# EAGLE design AMS00x (EAGLE 6.1)
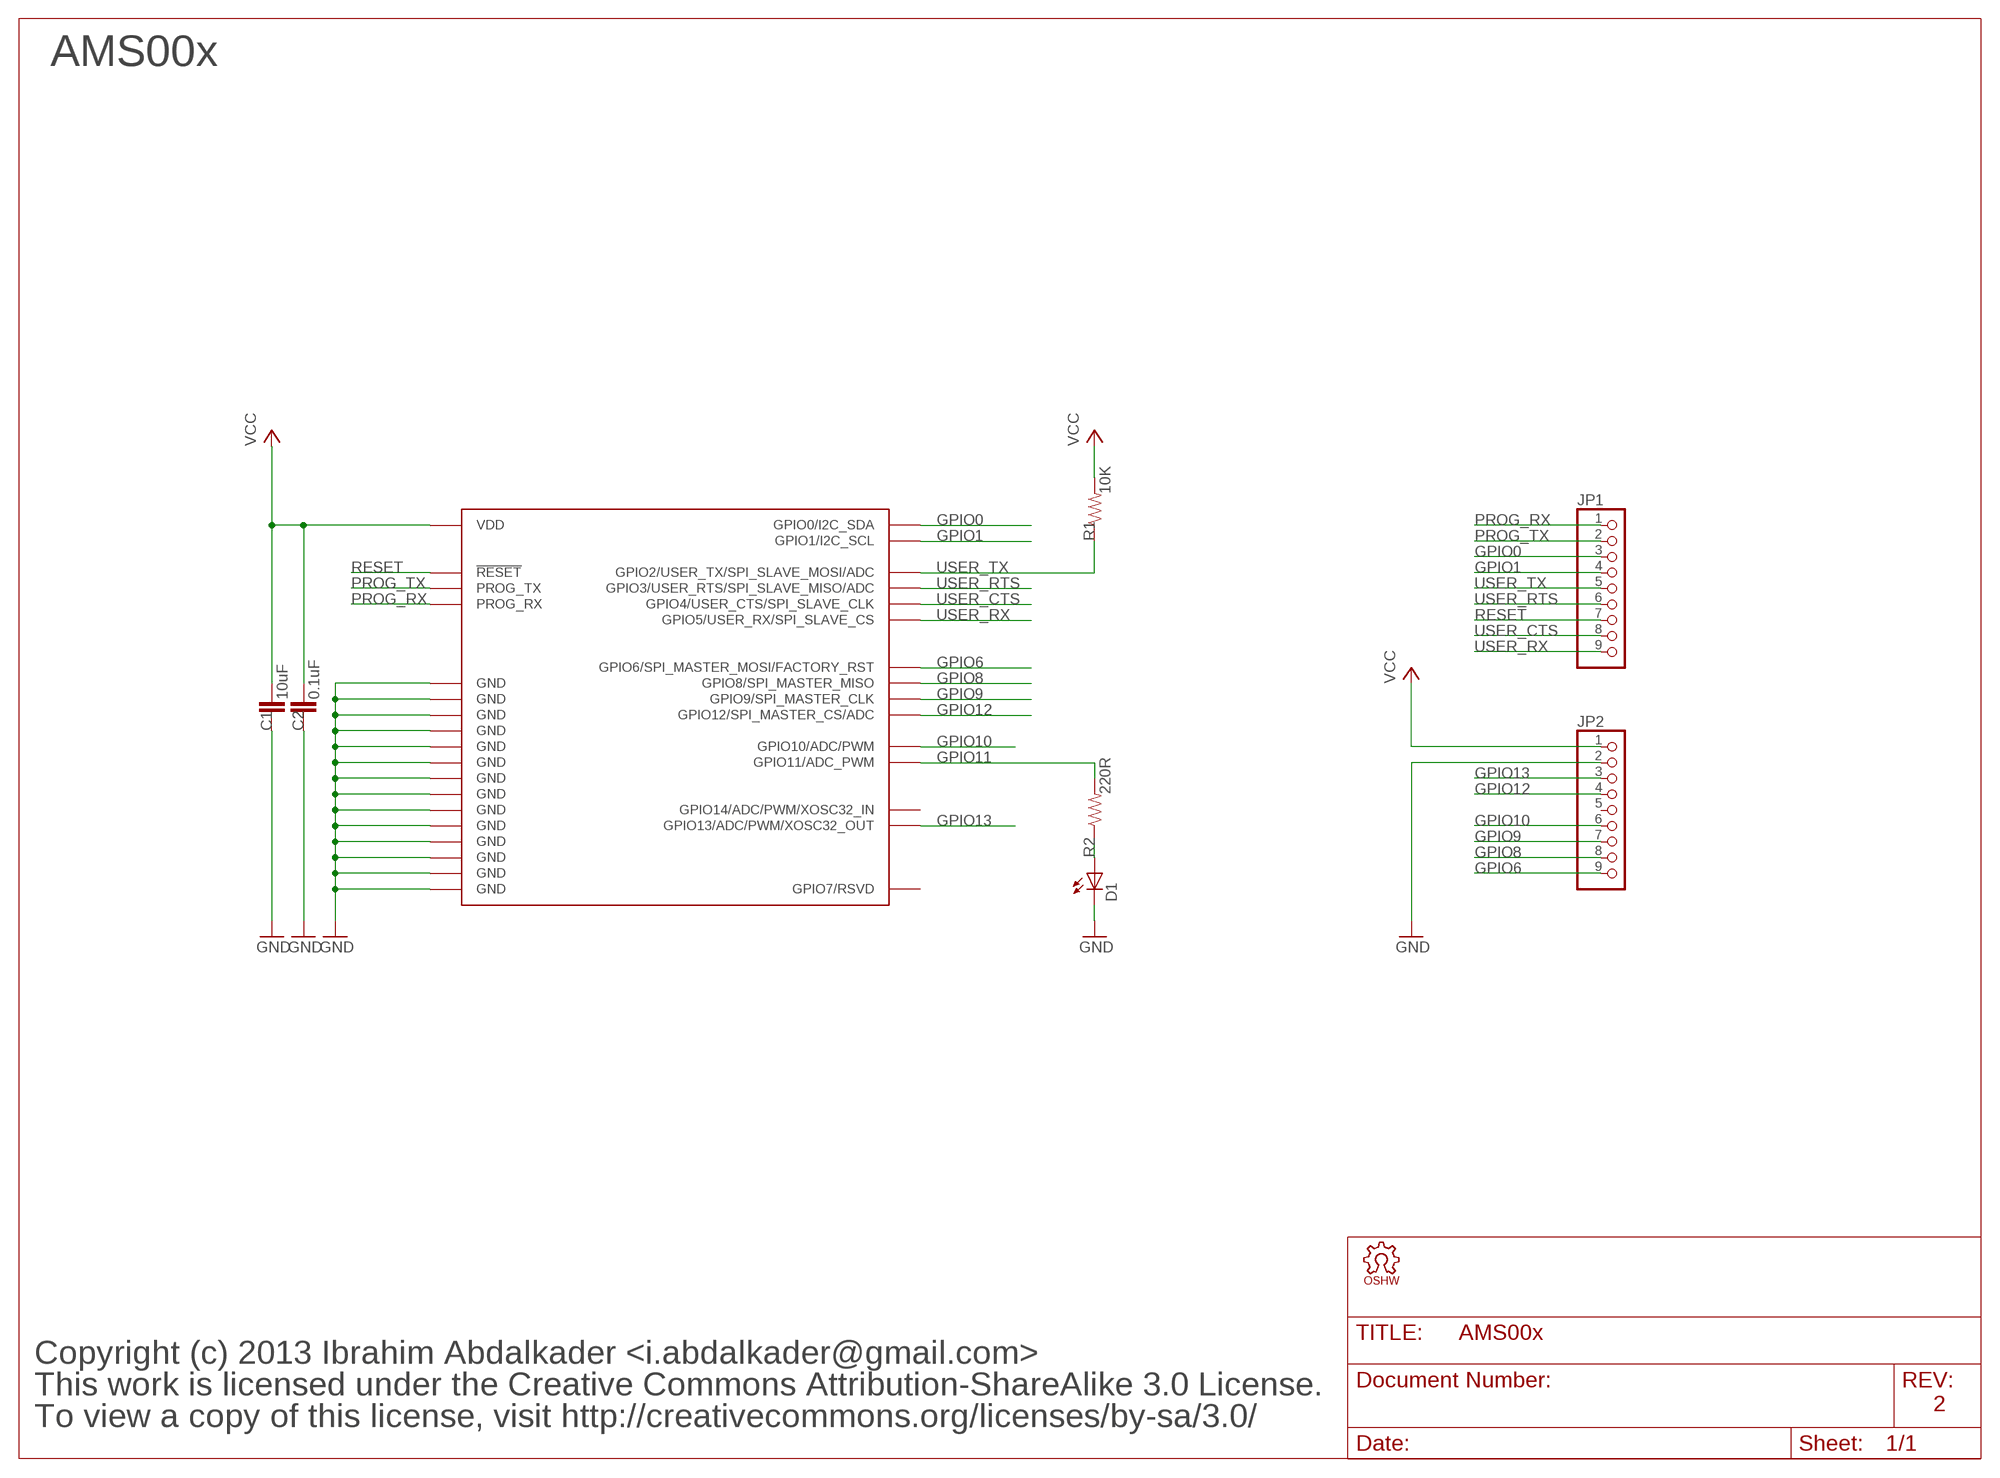
[diagram p0: schematic, sheet 1]

## Parts
C1  10uF  CAP0603-CAP  [0603-CAP]
C2  0.1uF  CAP0603-CAP  [0603-CAP]
D1  LED0603  [LED-0603]
JP1  PINHD-1X9  [1X09]
JP2  PINHD-1X9  [1X09]
LOGO1  OSHW_LOGO_6MILX0100-NT  [OSHW_6X100_NOTEXT]
R1  10K  RESISTOR0603-RES  [0603-RES]
R2  220R  RESISTOR0603-RES  [0603-RES]
U$3  AMS00X  [AMS00X]

## Nets
GND: C1.1 C2.1 D1.C JP2.2 U$3.P$1(GND) U$3.P$19(GND) U$3.P$22(GND) U$3.P$23(GND) U$3.P$24(GND) U$3.P$25(GND) U$3.P$26(GND) U$3.P$27(GND) U$3.P$28(GND) U$3.P$29(GND) U$3.P$30(GND) U$3.P$31(GND) U$3.P$32(GND) U$3.P$33(GND)
GPIO0: JP1.3 U$3.P$4(GPIO0/I2C_SDA)
GPIO1: JP1.4 U$3.P$5(GPIO1/I2C_SCL)
GPIO6: JP2.9 U$3.P$11(GPIO6/SPI_MASTER_MOSI/FACTORY_RST)
GPIO8: JP2.8 U$3.P$13(GPIO8/SPI_MASTER_MISO)
GPIO9: JP2.7 U$3.P$14(GPIO9/SPI_MASTER_CLK)
GPIO10: JP2.6 U$3.P$15(GPIO10/ADC/PWM)
GPIO11: R2.2 U$3.P$16(GPIO11/ADC_PWM)
GPIO12: JP2.4 U$3.P$17(GPIO12/SPI_MASTER_CS/ADC)
GPIO13: JP2.3 U$3.P$18(GPIO13/ADC/PWM/XOSC32_OUT)
N$14: D1.A R2.1
PROG_RX: JP1.1 U$3.P$2(PROG_RX)
PROG_TX: JP1.2 U$3.P$3(PROG_TX)
RESET: JP1.7 U$3.P$8(!RESET)
USER_CTS: JP1.8 U$3.P$9(GPIO4/USER_CTS/SPI_SLAVE_CLK)
USER_RTS: JP1.6 U$3.P$7(GPIO3/USER_RTS/SPI_SLAVE_MISO/ADC)
USER_RX: JP1.9 U$3.P$10(GPIO5/USER_RX/SPI_SLAVE_CS)
USER_TX: JP1.5 R1.1 U$3.P$6(GPIO2/USER_TX/SPI_SLAVE_MOSI/ADC)
VCC: C1.2 C2.2 JP2.1 R1.2 U$3.P$21(VDD)
Unconnected: JP2.5 U$3.P$12(GPIO7/RSVD) U$3.P$20(GPIO14/ADC/PWM/XOSC32_IN)

## Notes on the sheet
- AMS00x
- Copyright (c) 2013 Ibrahim Abdalkader <i.abdalkader@gmail.com>
- This work is licensed under the Creative Commons Attribution-ShareAlike 3.0 License.
- 2
- To view a copy of this license, visit http://creativecommons.org/licenses/by-sa/3.0/

## Library data of the parts
C1 C2 = sfe:CAP: Capacitor Standard 0603 ceramic capacitor, and 0.1" leaded capacitor.
D1 = sfe:LED: LEDs Standard schematic elements and footprints for 5mm, 3mm, 1206, and 0603 sized LEDs. 5mm - Spark Fun Electronics SKU : COM-00529 (and others)
JP1 JP2 = pinhead:PINHD-1X9: PIN HEADER
LOGO1 = iofault:OSHW_LOGO_6MIL
R1 R2 = sfe:RESISTOR: Resistor Basic schematic elements and footprints for 0603, 1206, and PTH resistors.
U$3 = AMS00x:AMS00X

## Net classes
1 vcc: width 1.016 mm, clearance 0.203 mm
2 antenna: width 0.363 mm, clearance 0.305 mm
3 1.8v: width 0.457 mm, clearance 0.254 mm

## Board
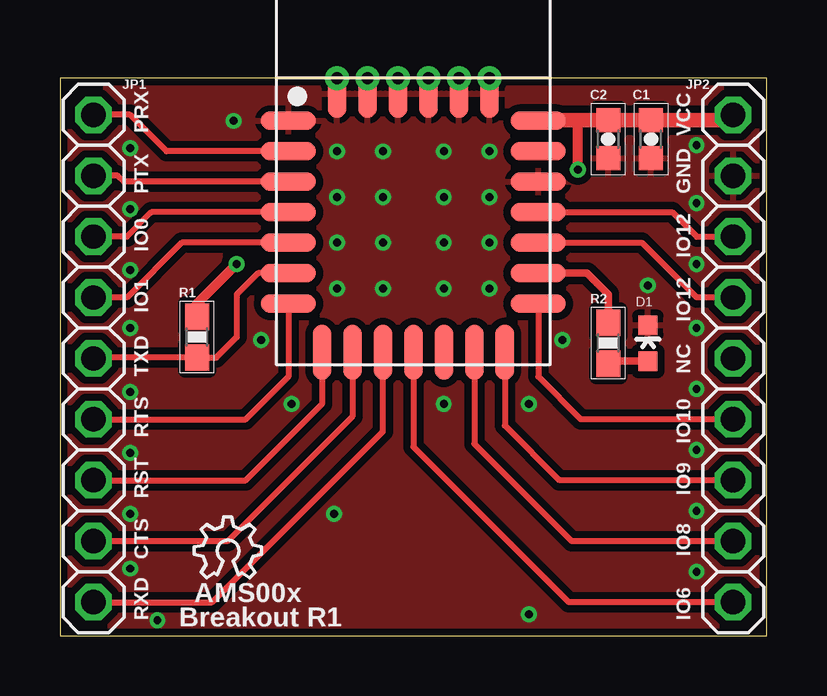
[diagram p1: board, top side]
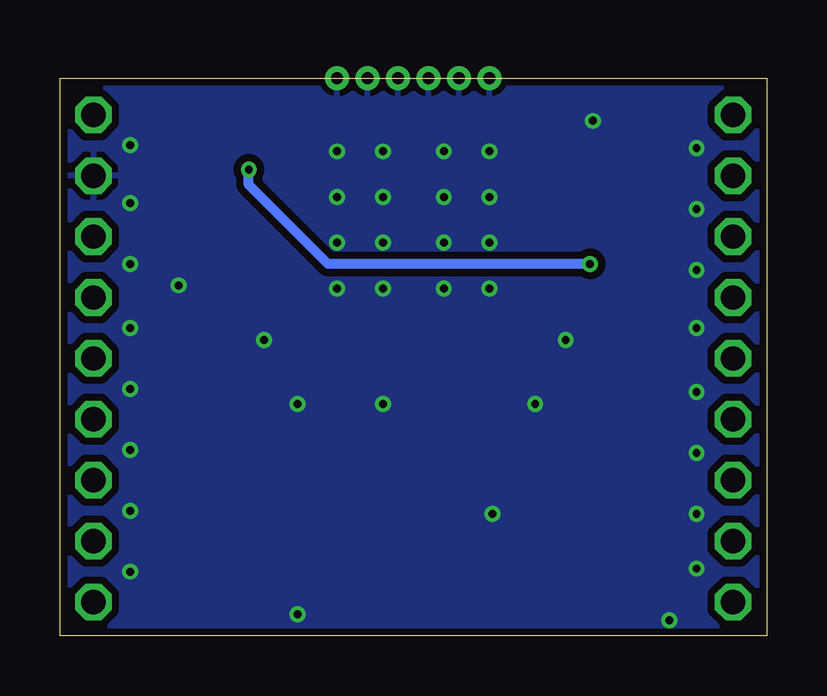
[diagram p2: board, bottom side, seen from below]

Size 29.46 x 23.24 mm. Coordinates in mm from the lower left corner, seen from the top.
Outline: 0,0 29.46,0 29.46,23.24 0,23.24 0,0
Copper layers (1*16): Top 0.035mm / dielectric 1.5mm / Bottom 0.035mm
Design rules: minimum track width 8mil, minimum drill 13mil, track to track 6mil, track to pad 6mil, pad to pad 6mil, via to via 6mil, smd to smd 6mil, copper to edge 5mil, drill to drill 10mil, minimum pad ring 10mil, minimum via ring 4mil, stop-mask expansion 3mil, vias tented up to drill 40mil, thermal gap 10mil

### Footprints (pad centres in the part's own frame; a part is rotated, then mirrored left to right if it is on the bottom)
0603-CAP = smd 1 x 1: 1 -0.8,0; 2 0.8,0
LED-0603 = smd 0.8 x 0.8: A 0,-0.75; C 0,0.75
1X09 = drill 1.016 octagon: 1 -10.16,0; 2 -7.62,0; 3 -5.08,0; 4 -2.54,0; 5 0,0; 6 2.54,0; 7 5.08,0; 8 7.62,0; 9 10.16,0
0603-RES = smd 1.1 x 1: 1 -0.85,0; 2 0.85,0
AMS00X = smd 2.286 x 0.762: P$1 0.508,10.16; P$2 0.508,8.89; P$3 0.508,7.62; P$4 0.508,6.35; P$5 0.508,5.08; P$6 0.508,3.81; P$7 0.508,2.54; P$15 10.922,2.54; P$16 10.922,3.81; P$17 10.922,5.08; P$18 10.922,6.35; P$19 10.922,7.62; P$20 10.922,8.89; P$21 10.922,10.16 | smd 0.762 x 2.286: P$8 1.905,0.508; P$9 3.175,0.508; P$10 4.445,0.508; P$11 5.715,0.508; P$12 6.985,0.508; P$13 8.255,0.508; P$14 9.525,0.508 | smd 0.762 x 2.032: P$22 8.89,11.303; P$23 7.62,11.303; P$24 6.35,11.303; P$25 5.08,11.303; P$26 3.81,11.303; P$27 2.54,11.303 | drill 0.5 pad 1: P$28 8.89,11.938; P$29 7.62,11.938; P$30 6.35,11.938; P$31 5.08,11.938; P$32 3.81,11.938; P$33 2.54,11.938

### Placement (x,y rotation side)
C1  24.64,20.7 90 top
C2  22.86,20.7 90 top
D1  24.51,12.19 0 top
JP1  1.4,11.56 270 top
JP2  28.07,11.56 270 top
LOGO1  5.59,2.41 0 top
R1  5.71,12.45 90 top
R2  22.86,12.19 90 top
U$3  9.02,11.3 0 top

### Tracks (layer width: path | path; a pad name or v marks a point on that pad's centre or on a via)
GND  (via drill 0.33)
  other vias: 16,20.19 13.46,20.19 11.56,20.19 11.56,18.29 17.91,18.29 17.91,14.48 17.91,16.38 13.46,16.38 16,16.38 16,18.29 13.46,18.29 11.56,16.38 11.56,14.48 26.54,7.75 26.54,2.67 19.56,0.89 4.06,0.64 2.92,2.79 2.92,10.16 2.92,15.24 2.92,17.78 2.92,20.32 7.24,21.46 13.46,14.48 2.92,7.62 16,14.48 26.54,12.83 2.92,5.08 26.54,5.21 26.54,10.29 16,9.65 19.56,9.65 9.65,9.65 2.92,12.83 26.54,15.49 11.43,5.08 20.95,12.32 8.38,12.32 26.54,18.03 26.54,20.45 17.91,20.19 24.51,14.61
  pour Top (isolate 0.305, rank 2): 0,0 0,23.24 29.46,23.24 29.46,0
  pour Bottom (isolate 0.305, rank 2): 0,0 0,23.24 29.46,23.24 29.46,0
GPIO0
  Top 0.254: U$3.P$4 3.81,17.65 2.79,16.64 JP1.3
GPIO1
  Top 0.254: U$3.P$5 5.08,16.38 2.79,14.1 JP1.4
GPIO6
  Top 0.254: JP2.9 21.21,1.4 14.73,7.87 U$3.P$11
GPIO8
  Top 0.254: JP2.8 21.34,3.94 17.27,8 U$3.P$13
GPIO9
  Top 0.254: JP2.7 20.83,6.48 18.54,8.76 U$3.P$14
GPIO10
  Top 0.254: U$3.P$15 19.94,10.79 21.72,9.02 JP2.6
GPIO11
  Top 0.305: U$3.P$16 21.97,15.11 22.86,14.22 R2.2
GPIO12
  Top 0.254: U$3.P$17 24.26,16.38 26.54,14.1 JP2.4
GPIO13
  Top 0.254: U$3.P$18 25.53,17.65 26.54,16.64 JP2.3
N$14
  Top 0.305: D1.A 22.96,11.44 R2.1
PROG_RX
  Top 0.254: U$3.P$2 4.45,20.19 2.92,21.72 JP1.1
PROG_TX
  Top 0.254: U$3.P$3 2.67,18.92 2.41,19.18 JP1.2
RESET
  Top 0.254: JP1.7 7.75,6.48 10.92,9.65 U$3.P$8
USER_CTS
  Top 0.254: U$3.P$9 12.19,9.14 6.99,3.94 JP1.8
USER_RTS
  Top 0.254: JP1.6 7.75,9.02 9.53,10.79 U$3.P$7
USER_RX
  Top 0.254: JP1.9 6.35,1.4 13.46,8.51 U$3.P$10
USER_TX
  Top 0.254: JP1.5 1.44,11.6 R1.1 6.52,11.6 7.37,12.45 7.37,14.22 8.26,15.11 U$3.P$6
VCC  (via drill 0.33)
  Top 0.406: R1.2 5.71,13.84 v7.37,15.49 | v21.59,19.43 21.59,21.37 21.46,21.5
  Top 0.61: JP2.1 27.85,21.5 C1.2 C2.2 21.46,21.5 19.98,21.5 U$3.P$21
  Bottom 0.406: v7.37,15.49 18.29,15.49 21.59,18.8 v21.59,19.43

### Text on the board
tPlace: PRX | VCC | PTX | GND | IO0 | IO12 | IO1 | IO12 | TXD | NC | RTS | IO10 | IO9 | RST | CTS | IO8 | AMS00x | RXD | Breakout R1 | IO6
Document: Antenna trace 12mils (50Ohms impedance) | Stackup: | 1 oz copper | 6.7 mil prepreg | 0.5 oz copper | 47 mil core | 0.5 oz copper | 6.7 mil prepreg | 1 oz copper | er is 3.66